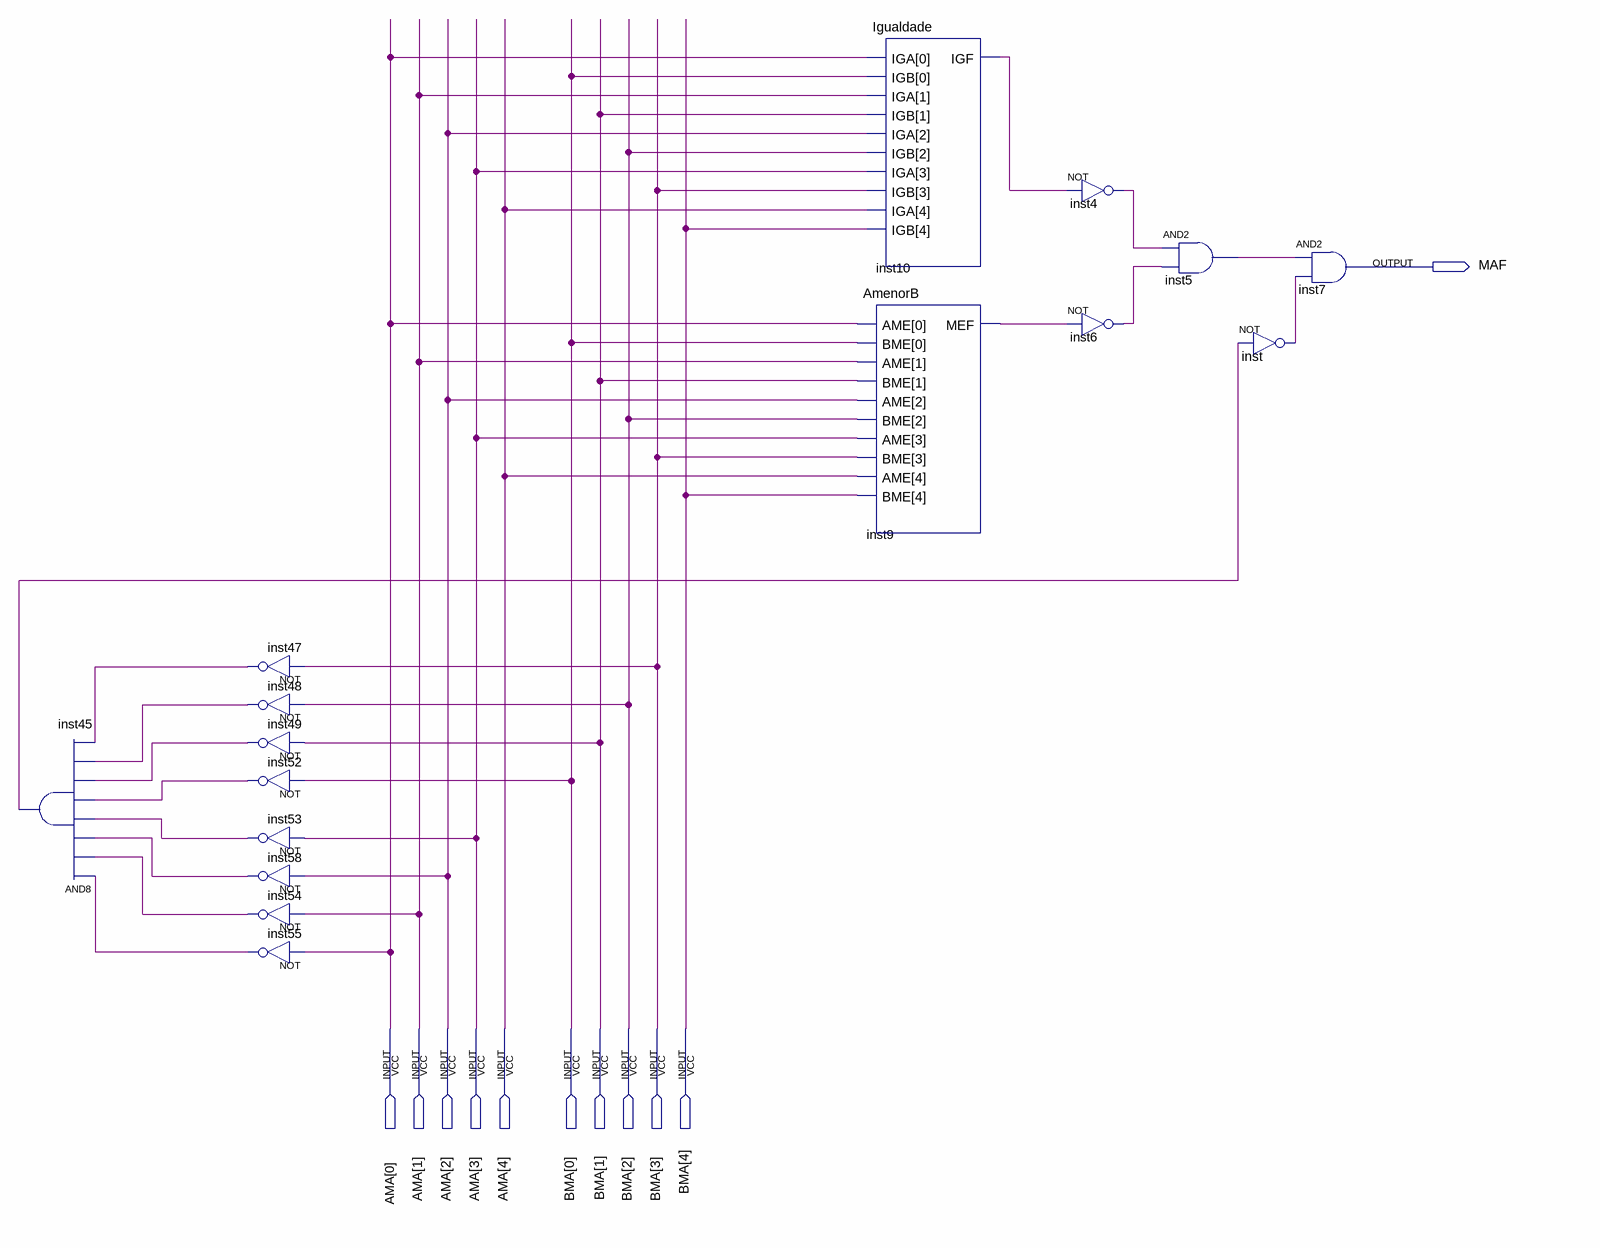
[diagram p0: schematic sheet]
// Quartus schematic AmaiorB.bdf as structural Verilog: 16 symbols, 11 pins
module AmaiorB (
  input  [4:0] AMA,
  input  [4:0] BMA,
  output MAF
);

  wire inst4_out, inst5_out, inst6_out, inst9_mef, inst10_igf, inst45_out, inst47_out, inst48_out,
       inst49_out, inst52_out, inst53_out, inst54_out, inst55_out, inst58_out, inst_out;

  and inst45 (inst45_out, inst55_out, inst54_out, inst58_out, inst53_out, inst52_out, inst49_out, inst48_out, inst47_out);
  not inst47 (inst47_out, BMA[3]);
  not inst48 (inst48_out, BMA[2]);
  not inst49 (inst49_out, BMA[1]);
  not inst52 (inst52_out, BMA[0]);
  not inst53 (inst53_out, AMA[3]);
  not inst58 (inst58_out, AMA[2]);
  not inst54 (inst54_out, AMA[1]);
  not inst55 (inst55_out, AMA[0]);
  Igualdade inst10 (.IGA(AMA), .IGB(BMA), .IGF(inst10_igf));
  AmenorB inst9 (.AME(AMA), .BME(BMA), .MEF(inst9_mef));
  not inst4 (inst4_out, inst10_igf);
  not inst6 (inst6_out, inst9_mef);
  and inst5 (inst5_out, inst4_out, inst6_out);
  and inst7 (MAF, inst5_out, inst_out);
  not inst (inst_out, inst45_out);
endmodule
